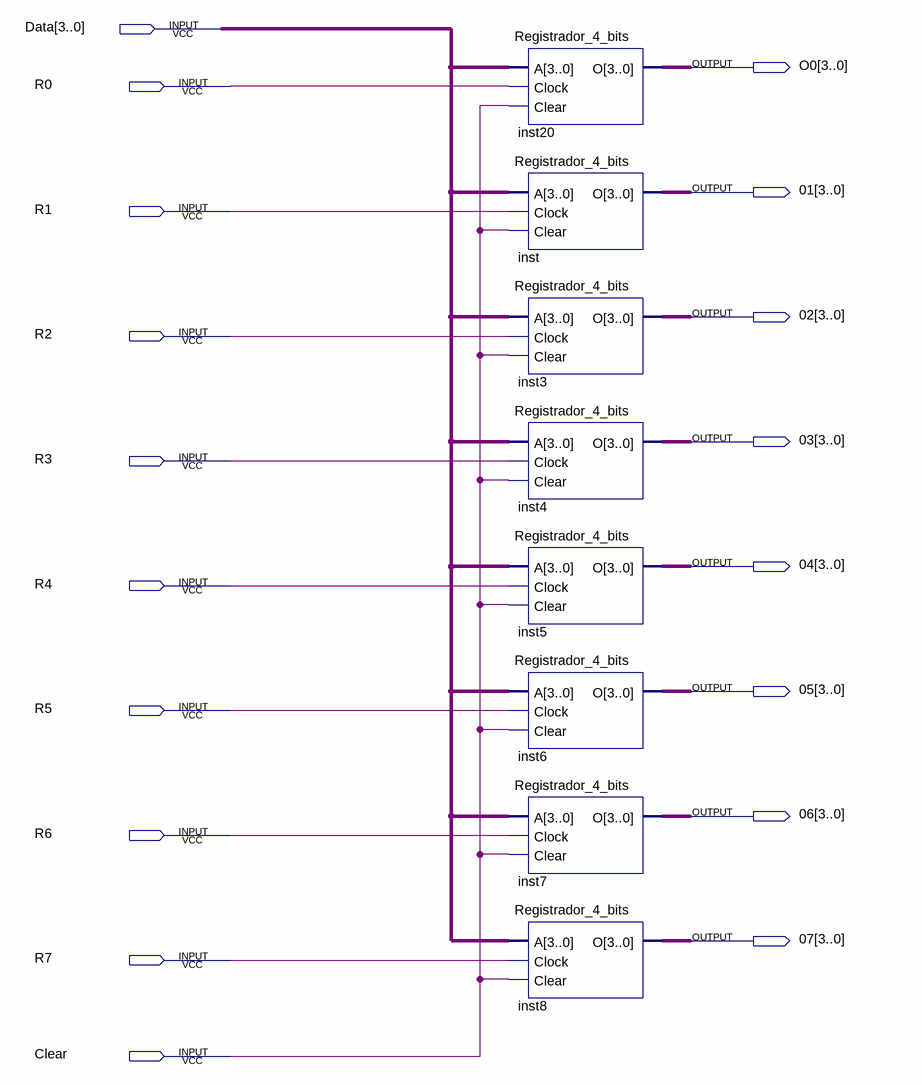
[diagram p0: schematic sheet]
// Quartus schematic 8_4_bits_registers.bdf as structural Verilog: 8 symbols, 18 pins
module \8_4_bits_registers  (
  input  [3:0] Data,
  input  R0,
  input  R1,
  input  R2,
  input  R3,
  input  R4,
  input  R5,
  input  R6,
  input  R7,
  input  Clear,
  output [3:0] O0,
  output [3:0] \01 ,
  output [3:0] \02 ,
  output [3:0] \03 ,
  output [3:0] \04 ,
  output [3:0] \05 ,
  output [3:0] \06 ,
  output [3:0] \07 
);

  Registrador_4_bits inst20 (.A(Data), .Clock(R0), .Clear(Clear), .O(O0));
  Registrador_4_bits inst (.A(Data), .Clock(R1), .Clear(Clear), .O(\01 ));
  Registrador_4_bits inst3 (.A(Data), .Clock(R2), .Clear(Clear), .O(\02 ));
  Registrador_4_bits inst4 (.A(Data), .Clock(R3), .Clear(Clear), .O(\03 ));
  Registrador_4_bits inst5 (.A(Data), .Clock(R4), .Clear(Clear), .O(\04 ));
  Registrador_4_bits inst6 (.A(Data), .Clock(R5), .Clear(Clear), .O(\05 ));
  Registrador_4_bits inst7 (.A(Data), .Clock(R6), .Clear(Clear), .O(\06 ));
  Registrador_4_bits inst8 (.A(Data), .Clock(R7), .Clear(Clear), .O(\07 ));
endmodule
